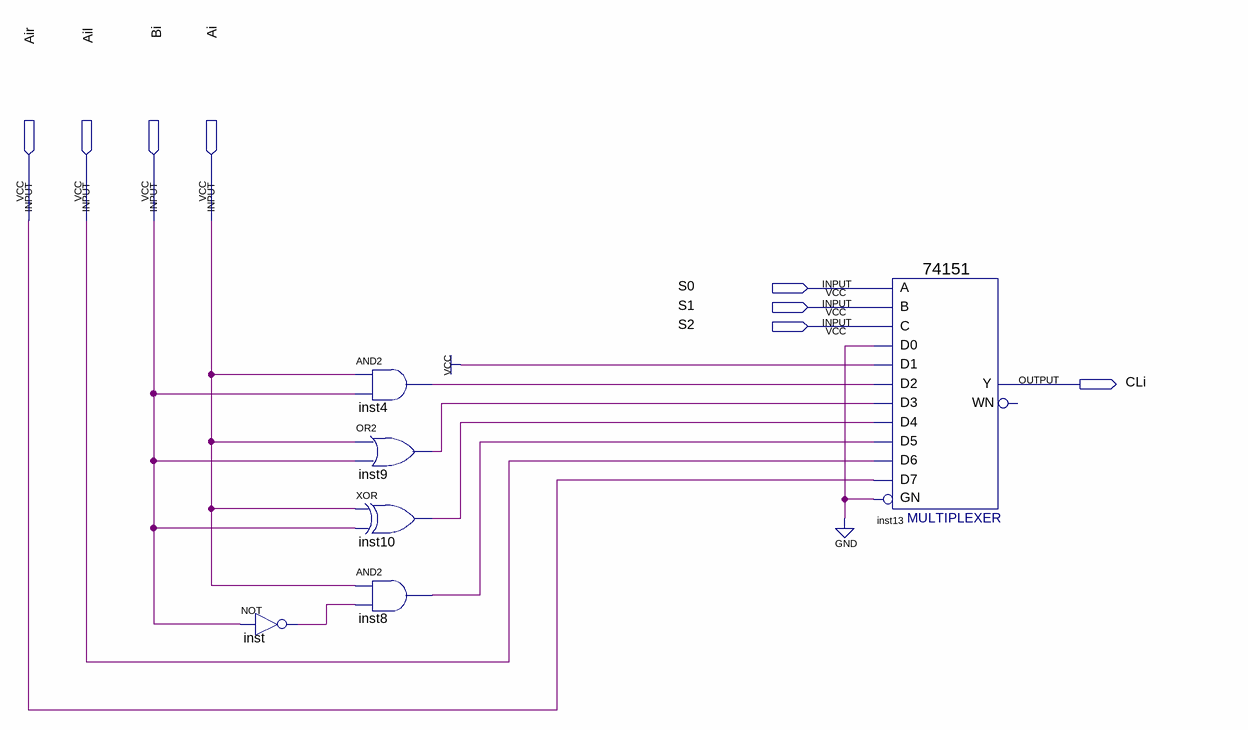
[diagram p0: schematic sheet]
// Quartus schematic logiccircuit1bit.bdf as structural Verilog: 6 symbols, 8 pins
module logiccircuit1bit (
  input  Air,
  input  Ail,
  input  Bi,
  input  Ai,
  input  S0,
  input  S1,
  input  S2,
  output CLi
);

  wire inst4_out, inst8_out, inst9_out, inst10_out, inst_out;

  not inst (inst_out, Bi);
  and inst4 (inst4_out, Ai, Bi);
  or inst9 (inst9_out, Ai, Bi);
  xor inst10 (inst10_out, Ai, Bi);
  and inst8 (inst8_out, Ai, inst_out);
  \74151  inst13 (
    .GN(1'b0), .C(S2), .B(S1), .A(S0), .D5(inst8_out), .D0(1'b0), .D1(1'b1), .D4(inst10_out), .D3(inst9_out),
    .D2(inst4_out), .D6(Ail), .D7(Air), .Y(CLi));  // open: WN
endmodule
